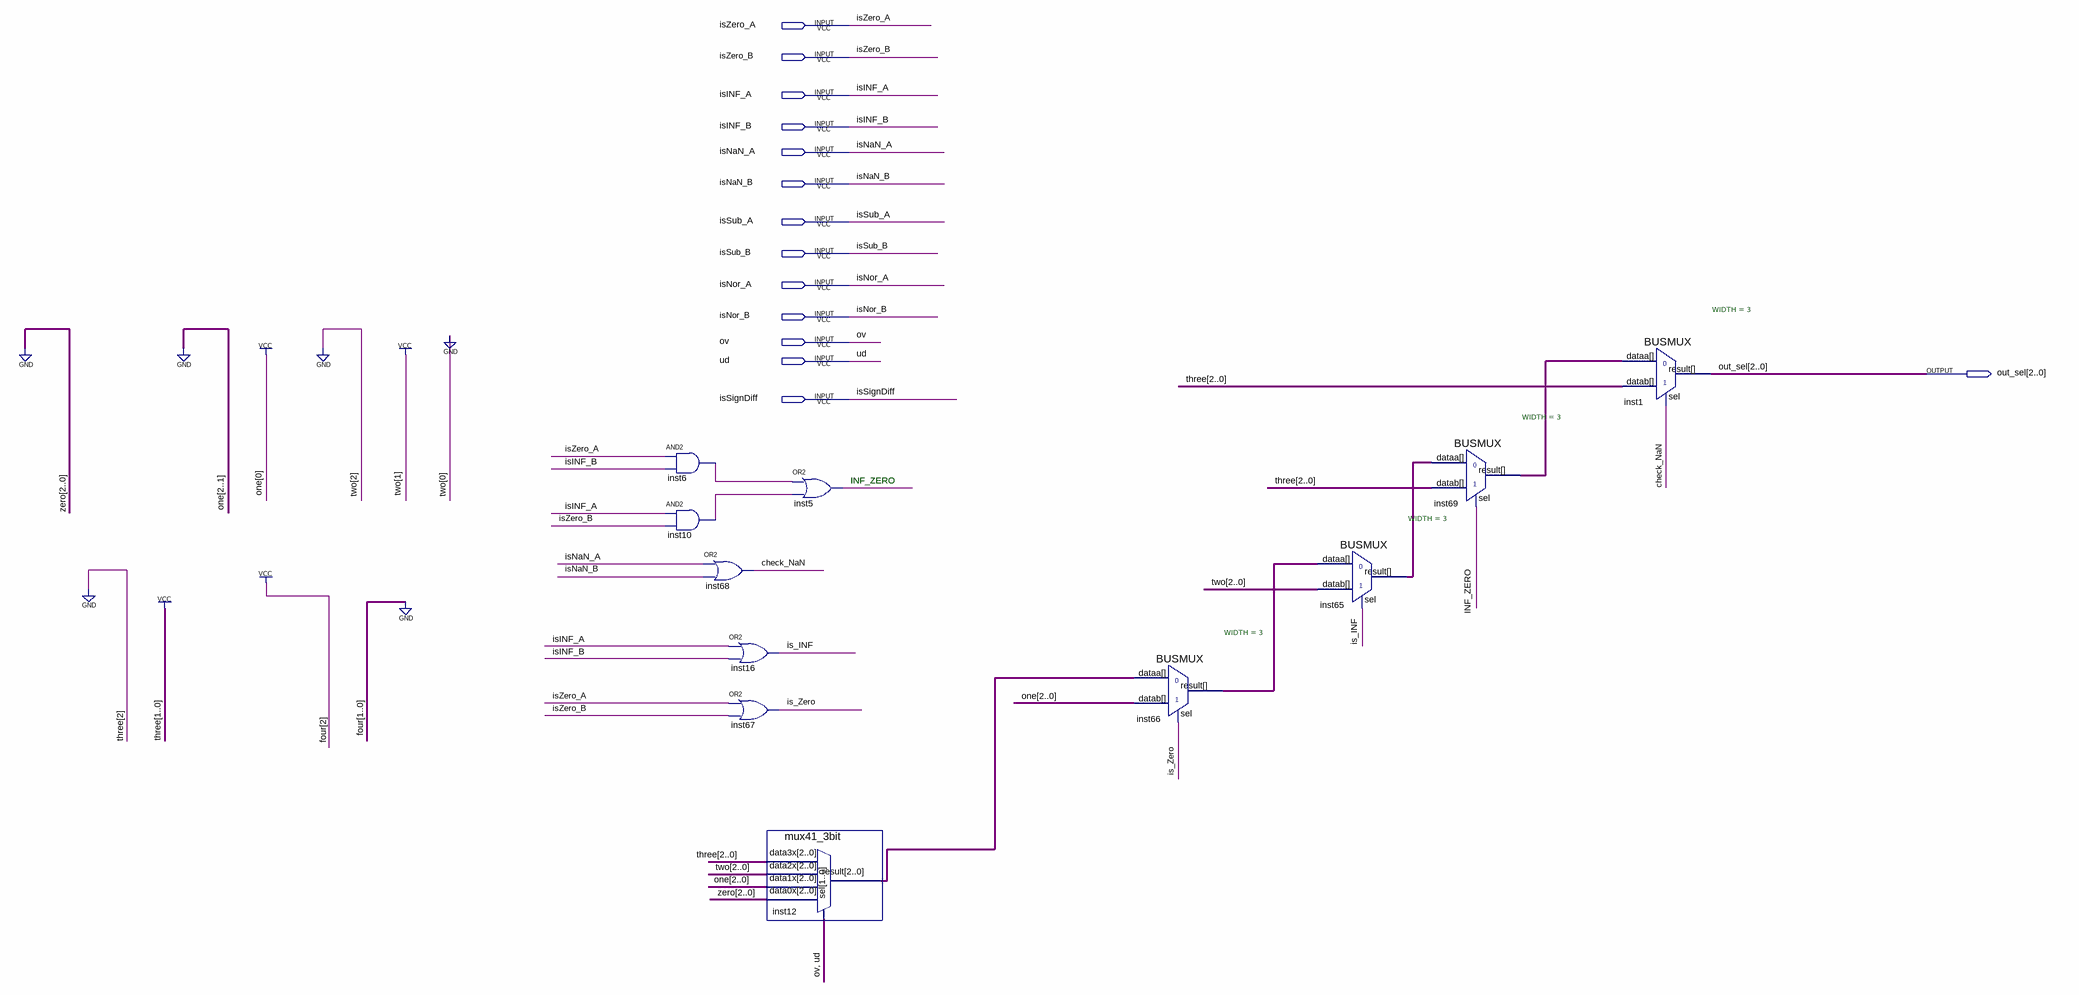
[diagram p0: schematic sheet]
// Quartus schematic Mult_control_unit.bdf as structural Verilog: 11 symbols, 14 pins
module Mult_control_unit (
  input  isZero_A,
  input  isZero_B,
  input  isINF_A,
  input  isINF_B,
  input  isNaN_A,
  input  isNaN_B,
  input  isSub_A,
  input  isSub_B,
  input  isNor_A,
  input  isNor_B,
  input  ov,
  input  ud,
  input  isSignDiff,
  output [2:0] out_sel
);

  wire check_NaN, INF_ZERO, inst6_out, inst10_out, is_INF, is_Zero;
  wire [2:0] inst12_result, inst65_result, inst66_result, inst69_result;

  and inst6 (inst6_out, isZero_A, isINF_B);
  and inst10 (inst10_out, isINF_A, isZero_B);
  or inst68 (check_NaN, isNaN_A, isNaN_B);
  or inst16 (is_INF, isINF_A, isINF_B);
  or inst67 (is_Zero, isZero_A, isZero_B);
  mux41_3bit inst12 (
    .data3x(3'b011), .data2x(3'b010), .data1x(3'b001), .data0x(3'b000), .sel({ov, ud}), .result(inst12_result));
  or inst5 (INF_ZERO, inst6_out, inst10_out);
  BUSMUX #(.WIDTH(3)) inst66 (.datab(3'b001), .sel(is_Zero), .dataa(inst12_result), .result(inst66_result));
  BUSMUX #(.WIDTH(3)) inst65 (.datab(3'b010), .sel(is_INF), .dataa(inst66_result), .result(inst65_result));
  BUSMUX #(.WIDTH(3)) inst69 (.datab(3'b011), .sel(INF_ZERO), .dataa(inst65_result), .result(inst69_result));
  BUSMUX #(.WIDTH(3)) inst1 (.datab(3'b011), .sel(check_NaN), .dataa(inst69_result), .result(out_sel));

  // Notes on the sheet:
  //   INF_ZERO
endmodule
